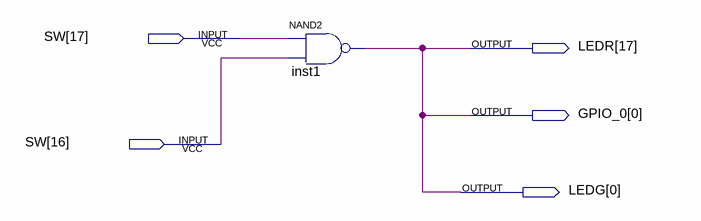
[diagram p0: schematic sheet]
// Quartus schematic nand.bdf as structural Verilog: 1 symbols, 5 pins
module \nand  (
  input  [17:16] SW,
  output [17:17] LEDR,
  output [0:0] GPIO_0,
  output [0:0] LEDG
);

  nand inst1 (GPIO_0[0], SW[17], SW[16]);

  assign LEDG[0] = GPIO_0[0];
  assign LEDR[17] = GPIO_0[0];
endmodule
